# Altium project SG3525_Card.PrjPcb
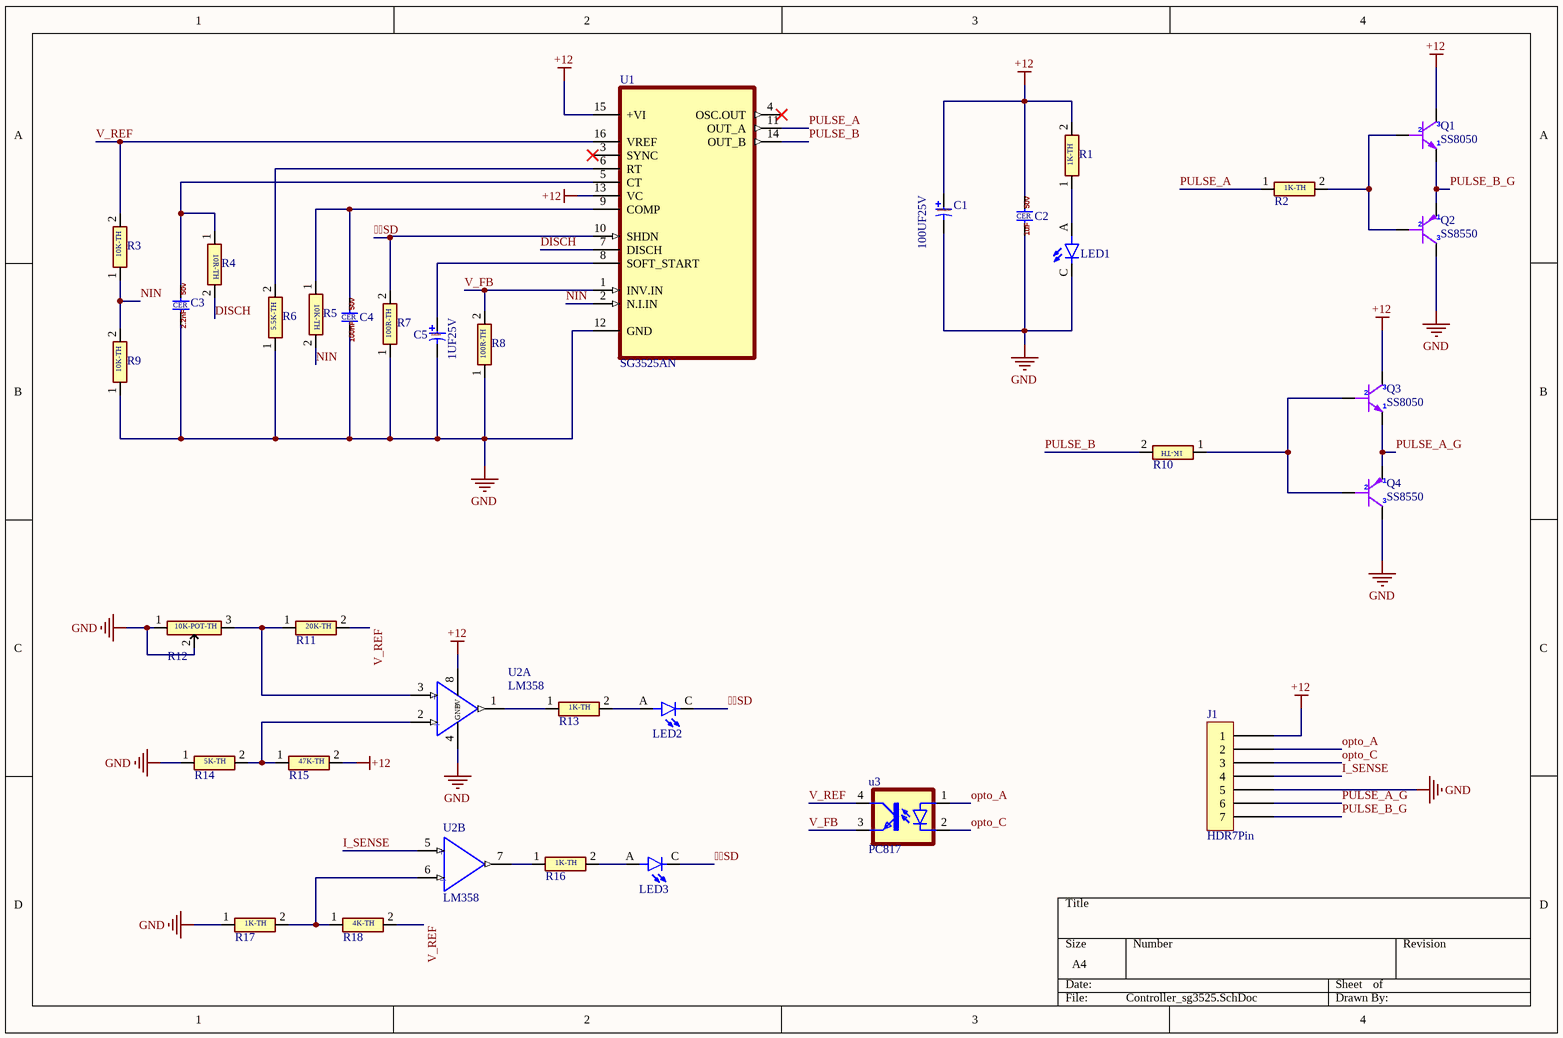
[diagram p0: Controller_sg3525.SchDoc]
1 sheet, 34 parts. Net scope: global (net labels, ports and power ports of the same name join across sheets).
Board file: controller_sg3525.PcbDoc

## Sheet Controller_sg3525.SchDoc
size A4; SheetNumber: 1; SheetTotal: 1

### Parts
C1  100UF25V  [CAP LS-1.5mm D4 H5]
C2  1UFCER  [CAP-CER-2.54]  (value not drawn)
C3  2.2NFCER  [CAP-CER-2.54]  (value not drawn)
C4  100nFCER  [CAP-CER-2.54]  (value not drawn)
C5  1UF25V  [CAP LS-1.5mm D4 H5]
J1  HDR7Pin  [HDR-TH 7P - male hader]
LED1  LED Red  [LED_5MM P2.5MM WHITE]  (value not drawn)
LED2  LED Red  [LED_5MM P2.5MM WHITE]  (value not drawn)
LED3  LED Red  [LED_5MM P2.5MM WHITE]  (value not drawn)
Q1  SS8050  [TO-92]
Q2  SS8550  [TO-92]
Q3  SS8050  [TO-92]
Q4  SS8550  [TO-92]
R1  1K  [RES-TH-7mm]  (value not drawn)
R2  1K  [RES-TH-7mm]  (value not drawn)
R3  10K  [RES-TH-7mm]  (value not drawn)
R4  10R  [RES-TH-7mm]  (value not drawn)
R5  10K  [RES-TH-7mm]  (value not drawn)
R6  5.5K  [RES-TH-7mm]  (value not drawn)
R7  100R  [RES-TH-7mm]  (value not drawn)
R8  100R  [RES-TH-7mm]  (value not drawn)
R9  10K  [RES-TH-7mm]  (value not drawn)
R10  1K  [RES-TH-7mm]  (value not drawn)
R11  20K  [RES-TH-7mm]  (value not drawn)
R12  10K  [TRIM_3296W-1-250]  (value not drawn)
R13  1K  [RES-TH-7mm]  (value not drawn)
R14  5K  [RES-TH-7mm]  (value not drawn)
R15  47K  [RES-TH-7mm]  (value not drawn)
R16  1K  [RES-TH-7mm]  (value not drawn)
R17  1K  [RES-TH-7mm]  (value not drawn)
R18  4K  [RES-TH-7mm]  (value not drawn)
U1  SG3525AN  [DIP-16]
U2  LM358  [DIP-8]  (parts A,B of 2)
u3  PC817  [DIP-4]

### Nets
+12: C1.1 C2.2 J1.1 Q1.3(C) Q3.3(C) R1.2 R15.2 U1.13(VC) U1.15(+VI) U2.8(+V)
GND: C1.2 C2.1 C3.1 C4.1 C5.2 J1.5 LED1.C Q2.3(C) Q4.3(C) R6.1 R7.1 R8.1 R9.1 R12.1 R12.2 R14.1 R17.1 U1.12(GND) U2.4(GND)
SD: LED2.C LED3.C R7.2 U1.10(SHDN)
DISCH: R4.2 U1.7(DISCH)
I_SENSE: J1.4 U2.5
NIN: R3.1 R5.2 R9.2 U1.2(N.I.IN)
opto_A: J1.2 u3.1(A)
opto_C: J1.3 u3.2(C)
PULSE_A: R2.1 U1.11(OUT_A)
PULSE_A_G: J1.6 Q3.1(E) Q4.1(E)
PULSE_B: R10.2 U1.14(OUT_B)
PULSE_B_G: J1.7 Q1.1(E) Q2.1(E)
V_FB: R8.2 U1.1(INV.IN) u3.3(EMIT)
V_REF: R3.2 R11.2 R18.2 U1.16(VREF) u3.4(COL)
NetC3_2: C3.2 R4.1 U1.5(CT)
NetC4_2: C4.2 R5.1 U1.9(COMP)
NetC5_1: C5.1 U1.8(SOFT_START)
NetLED1_A: LED1.A R1.1
NetLED2_A: LED2.A R13.2
NetLED3_A: LED3.A R16.2
NetQ1_2: Q1.2(B) Q2.2(B) R2.2
NetQ3_2: Q3.2(B) Q4.2(B) R10.1
NetR6_2: R6.2 U1.6(RT)
NetR11_1: R11.1 R12.3 U2.3
NetR13_1: R13.1 U2.1
NetR14_2: R14.2 R15.1 U2.2
NetR16_1: R16.1 U2.7
NetR17_2: R17.2 R18.1 U2.6

Not connected (* = marked no-connect by the designer): U1 3(SYNC)* 4(OSC.OUT)*

### Notes on the sheet
- (in symbol 1K) 1K-TH
- (in symbol 1UF25V) 1u25v
- (in symbol 1UFCER) 50v; CER; 1uF
- (in symbol 2.2NFCER) 50v; CER; 2.2nF
- (in symbol 4K) 4K-TH
- (in symbol 5.5K) 5.5K-TH
- (in symbol 5K) 5K-TH
- (in symbol 10K) 10K-TH
- (in symbol 10K POT) 10K-POT-TH
- (in symbol 10R) 10R-TH
- (in symbol 20K) 20K-TH
- (in symbol 47K) 47K-TH
- (in symbol 100nFCER_2) 50v; CER; 100nF
- (in symbol 100R_1) 100R-TH
- (in symbol 100UF25V) 100u25v
- (in symbol LM358, part A) +; _
- (in symbol LM358, part B) +; _

### Library data of the parts
C1 = 100UF25V: CAP TH AL: 100U 25V; LCSC Part #: C43351; Unit Price: 0.0057
C2 = 1UFCER: CAP: CER 1UF 50V; LCSC Part #: C1848; Unit Price: 0.0104
C3 = 2.2NFCER: CAP TH: CER 2.2nF; LCSC Part #: C1848; Unit Price: 0.0104
C4 = 100nFCER_2: CAP: CER 100nF 50V; LCSC Part #: C1848; Unit Price: 0.0104
C5 = 1UF25V: CAP TH AL: 1U 25V
J1 = HDR7Pin: HEADER: 1*7P Male
LED1-LED3 = LED Red: LED TH: 1.9V LED; LCSC Part #: C7470709
Q1 Q3 = SS8050: Transistor: 25V 300mW 120@100mA,1V 1.5A NPN SOT-23; LCSC Part #: C59205; Unit Price: 0.0048
Q2 Q4 = SS8550: Transistor: 25V 200mW 120@100mA,1V 1.5A PNP SOT-23 EVVO; LCSC Part #: C59205; Unit Price: 0.0048
R1 R2 R10 R13 R16 R17 = 1K: RES TH: 1K
R3 R5 R9 = 10K: RES TH: 10K
R4 = 10R: RES TH: 10R
R6 = 5.5K: RES TH: 5.5K
R7 R8 = 100R_1: RES TH: 100R
R11 = 20K: RES TH: 20K
R12 = 10K POT: RES TH: 10K POT
R14 = 5K: RES TH: 5K
R15 = 47K: RES TH: 47K
R18 = 4K: RES TH: 4K
U1 = SG3525AN: Buck, Push-Pull Regulator Positive Output Step-Down, Step-Up/Step-Down - DC-DC Controller IC 16-DIP; MF: STMicroelectronics; SnapEDA_Link: https://www.snapeda.com/parts/SG3525AN/STMicroelectronics/view-part/?ref=snap; Package: PDIP-16 ON Semiconductor; Value: *; MP: SG3525AN; Check_prices: https://www.snapeda.com/parts/SG3525AN/STMicroelectronics/view-part/?ref=eda
U2 = LM358: TH- dual opamp; MF: Texas Instruments; MP: LM7812CT/NOPB; SnapEDA_Link: https://www.snapeda.com/parts/LM7812CT/NOPB/Texas+Instruments/view-part/?ref=snap; Package: TO-220-3 Texas Instruments; Value: *; Check_prices: https://www.snapeda.com/parts/LM7812CT/NOPB/Texas+Instruments/view-part/?ref=eda
u3 = PC817: Optoisolator Transistor Output 5000Vrms 1 Channel 4-DIP